# EAGLE design TLC4LED (EAGLE 6.2)
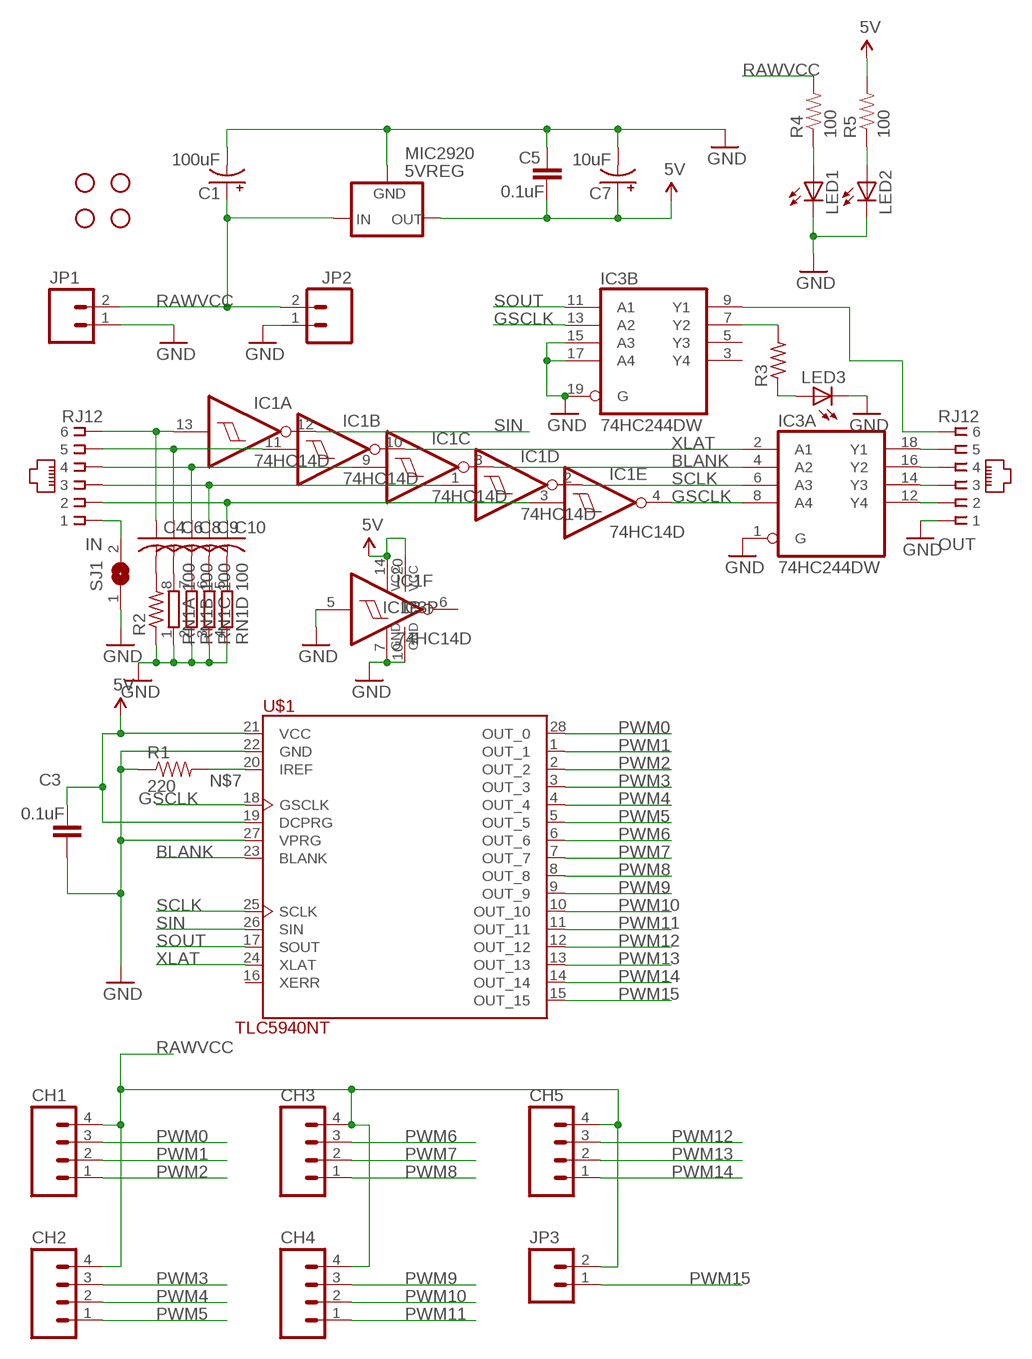
[diagram p0: schematic, sheet 1]

## Parts
5VREG  MIC2920  V_REG_MIC2920  [SOT223]
C1  100uF  CAP_POLD  [PANASONIC_D]
C3  0.1uF  CAP0805  [0805]
C4  C-US025-025X050  [C025-025X050]
C5  0.1uF  CAP0805  [0805]
C6  C-US025-025X050  [C025-025X050]
C7  10uF  CAP_POL1206  [EIA3216]
C8  C-US025-025X050  [C025-025X050]
C9  C-US025-025X050  [C025-025X050]
C10  C-US025-025X050  [C025-025X050]
CH1  M04SCREW  [SCREWTERMINAL-3.5MM-4]
CH2  M04SCREW  [SCREWTERMINAL-3.5MM-4]
CH3  M04SCREW  [SCREWTERMINAL-3.5MM-4]
CH4  M04SCREW  [SCREWTERMINAL-3.5MM-4]
CH5  M04SCREW  [SCREWTERMINAL-3.5MM-4]
IC1  74HC14D  [SO14]
IC3  74HC244DW  [SO20W]
IN  RJ12  RJ11-6L-B  [RJ11-NO_SHIELD]
JP1  M023.5MM  [SCREWTERMINAL-3.5MM-2]
JP2  M023.5MM  [SCREWTERMINAL-3.5MM-2]
JP3  M023.5MM  [SCREWTERMINAL-3.5MM-2]
JP4  STAND-OFF  [STAND-OFF]
JP5  STAND-OFF  [STAND-OFF]
JP6  STAND-OFF  [STAND-OFF]
JP7  STAND-OFF  [STAND-OFF]
LED1  LEDCHIPLED_0805  [CHIPLED_0805]
LED2  LEDCHIPLED_0805  [CHIPLED_0805]
LED3  LEDCHIPLED_0805  [CHIPLED_0805]
OUT  RJ12  RJ11-6L-B  [RJ11-NO_SHIELD]
R1  220  RESISTOR0805-RES  [0805]
R2  R-US_R0805  [R0805]
R3  R-US_R0805  [R0805]
R4  100  RESISTOR0805-RES  [0805]
R5  100  RESISTOR0805-RES  [0805]
RN1  100  4R-NEXBS8V  [EXBS8V]
SJ1  SJ  [SJ]
U$1  TLC5940NT  [DIP-28]

## Nets
5V [medium]: 5VREG.3(OUT) C3.2 C5.1 C7.A(+) IC1.14(P:VCC) IC3.20(P:VCC) R5.2 U$1.19(DCPRG) U$1.21(VCC)
BLANK: IC1.8(C:O) IC3.4(A:A2) U$1.23(BLANK)
GND [PWR]: 5VREG.2(GND) C1.- C3.1 C5.2 C7.C(-) IC1.5(F:I) IC1.7(P:GND) IC3.1(A:G) IC3.10(P:GND) IC3.15(B:A3) IC3.17(B:A4) IC3.19(B:G) JP1.1 JP2.1 LED1.C LED2.C LED3.C OUT.1 R1.1 R2.1 RN1.1 RN1.2 RN1.3 RN1.4 SJ1.1 U$1.22(GND) U$1.27(VPRG)
GSCLK: IC1.4(E:O) IC3.8(A:A4) IC3.13(B:A2) U$1.18(GSCLK)
N$1: IC3.12(A:Y4) OUT.2
N$2: IC3.14(A:Y3) OUT.3
N$3: IC3.16(A:Y2) OUT.4
N$4: IC3.18(A:Y1) OUT.5
N$5: LED2.A R5.1
N$6: LED1.A R4.1
N$7: R1.2 U$1.20(IREF)
N$8: C4.1 IC1.13(A:I) IN.6
N$9: C6.1 IC1.11(B:I) IN.5
N$10: C8.1 IC1.9(C:I) IN.4
N$11: C10.2 RN1.5
N$12: C9.2 RN1.6
N$13: C8.2 RN1.7
N$14: C9.1 IC1.1(D:I) IN.3
N$15: C10.1 IC1.3(E:I) IN.2
N$16: C6.2 RN1.8
N$17: C4.2 R2.2
N$18: IC3.9(B:Y1) OUT.6
N$19: IN.1 SJ1.2
N$20: IC3.7(B:Y2) R3.2
N$21: LED3.A R3.1
PWM0 [medium]: CH1.3 U$1.28(OUT_0)
PWM1 [medium]: CH1.2 U$1.1(OUT_1)
PWM2 [medium]: CH1.1 U$1.2(OUT_2)
PWM3 [medium]: CH2.3 U$1.3(OUT_3)
PWM4 [medium]: CH2.2 U$1.4(OUT_4)
PWM5 [medium]: CH2.1 U$1.5(OUT_5)
PWM6 [medium]: CH3.3 U$1.6(OUT_6)
PWM7 [medium]: CH3.2 U$1.7(OUT_7)
PWM8 [medium]: CH3.1 U$1.8(OUT_8)
PWM9 [medium]: CH4.3 U$1.9(OUT_9)
PWM10 [medium]: CH4.2 U$1.10(OUT_10)
PWM11 [medium]: CH4.1 U$1.11(OUT_11)
PWM12 [medium]: CH5.3 U$1.12(OUT_12)
PWM13 [medium]: CH5.2 U$1.13(OUT_13)
PWM14 [medium]: CH5.1 U$1.14(OUT_14)
PWM15 [medium]: JP3.1 U$1.15(OUT_15)
RAWVCC [PWR]: 5VREG.1(IN) C1.+ CH1.4 CH2.4 CH3.4 CH4.4 CH5.4 JP1.2 JP2.2 JP3.2 R4.2
SCLK: IC1.2(D:O) IC3.6(A:A3) U$1.25(SCLK)
SIN: IC1.12(A:O) U$1.26(SIN)
SOUT: IC3.11(B:A1) U$1.17(SOUT)
XLAT: IC1.10(B:O) IC3.2(A:A1) U$1.24(XLAT)
Unconnected: IC1.6(F:O) IC3.3(B:Y4) IC3.5(B:Y3) U$1.16(XERR)

## Library data of the parts
5VREG = SparkFun:V_REG_MIC2920: MIC2920A (http://www.micrel.com/_PDF/mic2920.pdf) - 400mA output LDO Regulator
C1 C7 = SparkFun:CAP_POL: Capacitor Polarized These are standard SMD and PTH capacitors. Normally 10uF, 47uF, and 100uF in electrolytic and tantalum varieties. Always verify the external diameter of the through hole cap, it varies with capacity, voltage, and manufacturer. The EIA devices should be standard.
C3 C5 = SparkFun:CAP: Capacitor Standard 0603 ceramic capacitor, and 0.1" leaded capacitor.
C4 C6 C8-C10 = rcl:C-US: CAPACITOR, American symbol
CH1-CH5 = SparkFun:M04: Header 4 Standard 4-pin 0.1" header. Use with straight break away headers (SKU : PRT-00116), right angle break away headers (PRT-00553), swiss pins (PRT-00743), machine pins (PRT-00117), and female headers (PRT-00115). Molex polarized connector foot print use with SKU : PRT-08231 with associated crimp pins and housings. 1MM SMD Version SKU: PRT-10208
IC1 = 74xx-eu:74*14: Hex schmitt trigger INVERTER
IC3 = 74xx-eu:74*244: Octal BUFFER and LINE DRIVER, 3-state
IN OUT = con-tycoelectronics:RJ11: CORCOM Modular RJ Jacks No Shield Source: www.tycoelectronics.com .. ENG_DS_1654001_1099_RJ_L_0507.pdf; MF: TYCO ELECTRONICS; MPN: RJ11-6L-B; OC_FARNELL: unknown; OC_NEWARK: 52K3613
JP1-JP3 = SparkFun:M02: Header 2 Standard 2-pin 0.1" header. Use with straight break away headers (SKU : PRT-00116), right angle break away headers (PRT-00553), swiss pins (PRT-00743), machine pins (PRT-00117), and female headers (PRT-00115). Molex polarized connector foot print use with SKU : PRT-08233 with associated crimp pins and housings.
JP4-JP7 = SparkFun:STAND-OFF: Stand Off This is the mechanical footprint for a #4 phillips button head screw. Use the keepout ring to avoid running the screw head into surrounding components. SKU : PRT-00447
LED1-LED3 = led:LED: LED OSRAM: - CHIPLED LG R971, LG N971, LY N971, LG Q971, LY Q971, LO R971, LY R971 LH N974, LH R974 LS Q976, LO Q976, LY Q976 LO Q996 - Hyper CHIPLED LW Q18S LB Q993, LB Q99A, LB R99A - SideLED LS A670, LO A670, LY A670, LG A670, LP A670 LB A673, LV A673, LT A673, LW A673 LH A674 LY A675 LS A676, LA A676, LO A676, LY A676, LW A676 LS A679, LY A679, LG A679 - Hyper Micro SIDELED® LS Y876, LA Y876, LO Y876, LY Y876 LT Y87S - SmartLED LW L88C, LW L88S LB L89C, LB L89S, LG L890 LS L89K, LO L89K, LY L89K LS L896, LA L896, LO L896, LY L896 - TOPLED LS T670, LO T670, LY T670, LG T670, LP T670 LSG T670, LSP T670, LSY T670, LOP T670, LYG T670 LG T671, LOG T671, LSG T671 LB T673, LV T673, LT T673, LW T673 LH T674 LS T676, LA T676, LO T676, LY T676, LB T676, LH T676, LSB T676, LW T676 LB T67C, LV T67C, LT T67C, LS T67K, LO T67K, LY T67K, LW E67C LS E67B, LA E67B, LO E67B, LY E67B, LB E67C, LV E67C, LT E67C LW T67C LS T679, LY T679, LG T679 LS T770, LO T770, LY T770, LG T770, LP T770 LB T773, LV T773, LT T773, LW T773 LH T774 LS E675, LA E675, LY E675, LS T675 LS T776, LA T776, LO T776, LY T776, LB T776 LHGB T686 LT T68C, LB T68C - Hyper Mini TOPLED® LB M676 - Mini TOPLED Santana® LG M470 LS M47K, LO M47K, LY M47K Source: http://www.osram.convergy.de LUXEON: - LUMILED® LXK2-PW12-R00, LXK2-PW12-S00, LXK2-PW14-U00, LXK2-PW14-V00 LXK2-PM12-R00, LXK2-PM12-S00, LXK2-PM14-U00 LXK2-PE12-Q00, LXK2-PE12-R00, LXK2-PE12-S00, LXK2-PE14-T00, LXK2-PE14-U00 LXK2-PB12-K00, LXK2-PB12-L00, LXK2-PB12-M00, LXK2-PB14-N00, LXK2-PB14-P00, LXK2-PB14-Q00 LXK2-PR12-L00, LXK2-PR12-M00, LXK2-PR14-Q00, LXK2-PR14-R00 LXK2-PD12-Q00, LXK2-PD12-R00, LXK2-PD12-S00 LXK2-PH12-R00, LXK2-PH12-S00 LXK2-PL12-P00, LXK2-PL12-Q00, LXK2-PL12-R00 Source: www.luxeon.com KINGBRIGHT: KA-3528ASYC Source: www.kingbright.com
R1 R4 R5 = SparkFun:RESISTOR: Resistor Basic schematic elements and footprints for 0603, 1206, and PTH resistors.
R2 R3 = rcl:R-US_: RESISTOR, American symbol
RN1 = resistor-dil:4R-N: Array Chip Resistor Source: RS Component / Phycomp; OC_FARNELL: unknown; OC_NEWARK: unknown
SJ1 = jumper:SJ: SMD solder JUMPER
U$1 = tlc5940:TLC5940

## Net classes
0 SIGNAL: width 0.254 mm
1 PWR: width 0.508 mm
2 medium: width 0.305 mm

## Board
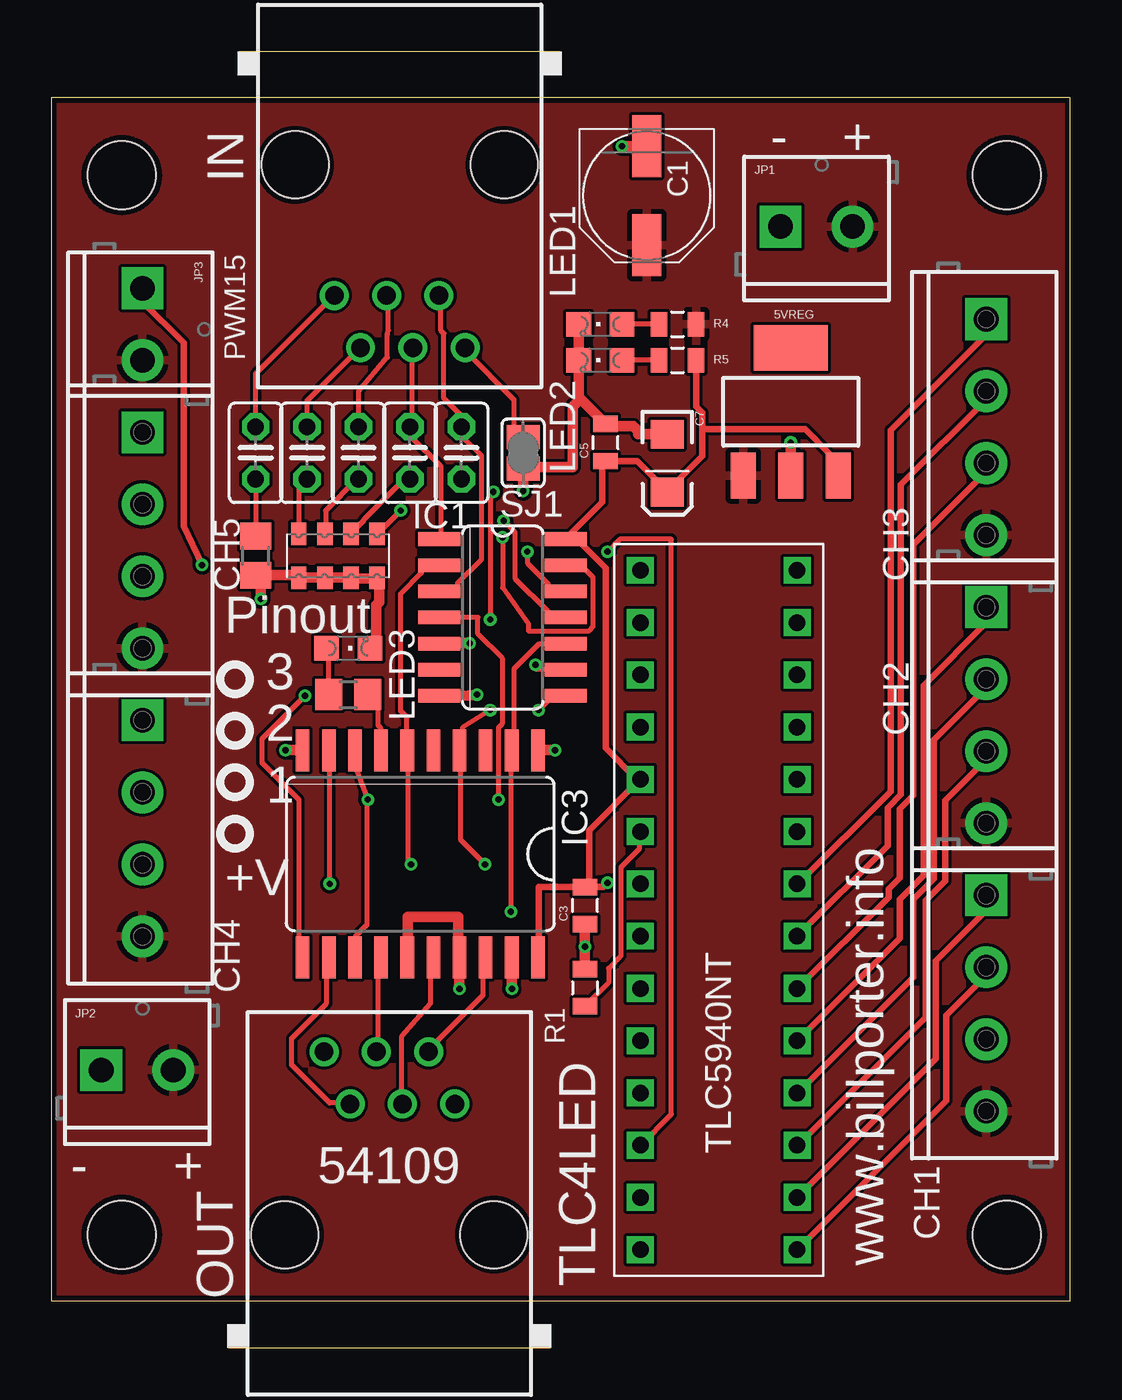
[diagram p1: board, top side]
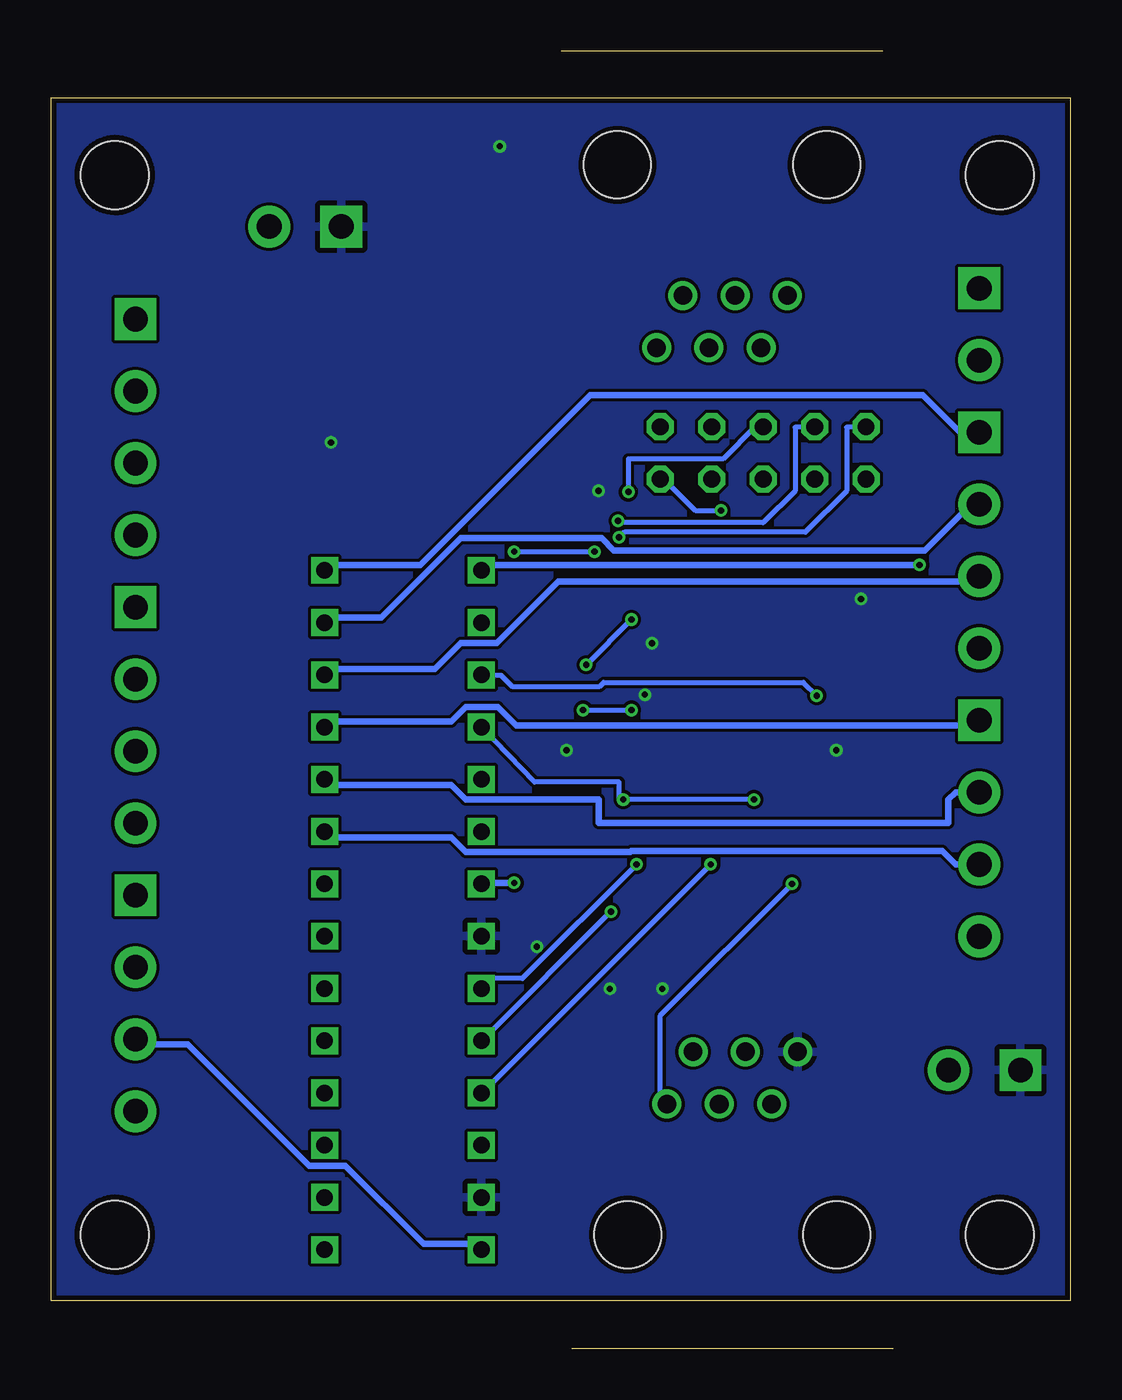
[diagram p2: board, bottom side, seen from below]

Size 49.5 x 58.49 mm. Coordinates in mm from the lower left corner, seen from the top.
Outline: 0,0 49.5,0 49.5,58.49 0,58.49 0,0
Copper layers (1*16): Top 0.035mm / dielectric 1.5mm / Bottom 0.035mm
Design rules: minimum track width 6mil, minimum drill 12mil, track to track 6mil, track to pad 6mil, pad to pad 6mil, via to via 6mil, smd to smd 0mil, copper to edge 10mil, drill to drill 10mil, minimum pad ring 10mil, minimum via ring 6mil, stop-mask expansion 2mil, vias tented up to drill 100mil, thermal gap 10mil

### Footprints (pad centres in the part's own frame; a part is rotated, then mirrored left to right if it is on the bottom)
SOT223 = smd 1.219 x 2.235: 1 -2.311,-3.099; 2 0,-3.099; 3 2.311,-3.099 | smd 3.6 x 2.2: 4 0,3.099
PANASONIC_D = smd 3 x 1.4: + 2.4,0; - -2.4,0
0805 = smd 0.8 x 1.2: 1 -0.9,0; 2 0.9,0
C025-025X050 = drill 0.813 octagon: 1 -1.27,0; 2 1.27,0
EIA3216 = smd 1.4 x 1.6: A 1.4,0; C -1.4,0
SCREWTERMINAL-3.5MM-4 = drill 1.2 pad 2.032 square: 1 0,0 | drill 1.2 pad 2.032: 2 3.5,0; 3 7,0; 4 10.5,0
SO14 = smd 0.66 x 2.032: 1 -3.81,-3.073; 2 -2.54,-3.073; 3 -1.27,-3.073; 4 0,-3.073; 5 1.27,-3.073; 6 2.54,-3.073; 7 3.81,-3.073; 8 3.81,3.073; 9 2.54,3.073; 10 1.27,3.073; 11 0,3.073; 12 -1.27,3.073; 13 -2.54,3.073; 14 -3.81,3.073
SO20W = smd 0.66 x 2.032: 1 -5.715,-5.029; 2 -4.445,-5.029; 3 -3.175,-5.029; 4 -1.905,-5.029; 5 -0.635,-5.029; 6 0.635,-5.029; 7 1.905,-5.029; 8 3.175,-5.029; 9 4.445,-5.029; 10 5.715,-5.029; 11 5.715,5.029; 12 4.445,5.029; 13 3.175,5.029; 14 1.905,5.029; 15 0.635,5.029; 16 -0.635,5.029; 17 -1.905,5.029; 18 -3.175,5.029; 19 -4.445,5.029; 20 -5.715,5.029
RJ11-NO_SHIELD = drill 0.9 pad 1.4: 1 -3.175,8.89; 2 -1.905,6.35; 3 -0.635,8.89; 4 0.635,6.35; 5 1.905,8.89; 6 3.175,6.35 | hole 3.251: -5.08,0; 5.08,0
SCREWTERMINAL-3.5MM-2 = drill 1.2 pad 2.032 square: 1 0,0 | drill 1.2 pad 2.032: 2 3.5,0
STAND-OFF = hole 3.302: 0,0
CHIPLED_0805 = smd 1.2 x 1.2: A 0,-1.05; C 0,1.05
R0805 = smd 1.3 x 1.5: 1 -0.95,0; 2 0.95,0
EXBS8V = smd 0.75 x 1.1: 1 -1.905,-1.07; 2 -0.635,-1.07; 3 0.635,-1.07; 4 1.905,-1.07; 5 1.905,1.07; 6 0.635,1.07; 7 -0.635,1.07; 8 -1.905,1.07
SJ = smd 1.168 x 1.6: 1 -0.762,0; 2 0.762,0
DIP-28 = drill 0.8 square: 1 -3.81,-1.27; 2 -3.81,-3.81; 3 -3.81,-6.35; 4 -3.81,-8.89; 5 -3.81,-11.43; 6 -3.81,-13.97; 7 -3.81,-16.51; 8 -3.81,-19.05; 9 -3.81,-21.59; 10 -3.81,-24.13; 11 -3.81,-26.67; 12 -3.81,-29.21; 13 -3.81,-31.75; 14 -3.81,-34.29; 15 3.81,-34.29; 16 3.81,-31.75; 17 3.81,-29.21; 18 3.81,-26.67; 19 3.81,-24.13; 20 3.81,-21.59; 21 3.81,-19.05; 22 3.81,-16.51; 23 3.81,-13.97; 24 3.81,-11.43; 25 3.81,-8.89; 26 3.81,-6.35; 27 3.81,-3.81; 28 3.81,-1.27

### Placement (x,y rotation side)
5VREG  35.92,43.22 0 top
C1  28.92,53.72 270 top
C3  25.92,19.22 90 top
C4  9.92,41.22 270 top
C5  26.92,41.72 90 top
C6  12.42,41.22 270 top
C7  29.92,40.72 270 top
C8  14.92,41.22 270 top
C9  17.42,41.22 270 top
C10  19.92,41.22 270 top
CH1  45.42,19.72 270 top
CH2  45.42,33.72 270 top
CH3  45.42,47.72 270 top
CH4  4.42,28.22 270 top
CH5  4.42,42.22 270 top
IC1  21.92,33.22 270 top
IC3  17.92,21.72 180 top
IN  16.92,55.22 180 top
JP1  35.42,52.22 0 top
JP2  2.42,11.22 0 top
JP3  4.42,49.22 270 top
JP4  3.42,3.22 0 top
JP5  46.42,3.22 0 top
JP6  3.42,54.72 0 top
JP7  46.42,54.72 0 top
LED1  26.67,47.47 90 top
LED2  26.67,45.72 90 top
LED3  14.42,31.72 270 top
OUT  16.42,3.22 0 top
R1  25.92,15.22 270 top
R2  9.92,36.22 90 top
R3  14.42,29.47 0 top
R4  30.42,47.47 0 top
R5  30.42,45.72 0 top
RN1  13.92,36.22 0 top
SJ1  22.92,41.22 90 top
U$1  32.42,1.22 180 top

### Tracks (layer width: path | path; a pad name or v marks a point on that pad's centre or on a via)
5V  (via drill 0.3)
  Top 0.305: C3.2 23.67,20.12 23.67,16.72 IC3.20 | v27.02,20.32 26.82,20.12 C3.2 | C3.2 26.12,20.27 26.12,22.87 28.57,25.32 U$1.19 28.42,25.37 26.92,26.87 26.92,35.62 25.37,37.17 25.37,37.22 IC1.14 25.02,37.07 26.77,38.82 26.77,40.77 C5.1 28.47,40.82 29.92,39.37 C7.A 30.02,39.47 31.62,41.07 31.62,42.37 | R5.2 31.32,43.47 31.62,43.17 31.62,42.37 | 31.62,42.37 36.62,42.37 37.82,41.17 37.82,40.57 38.22,40.17 5VREG.3
  Bottom 0.305: v27.02,20.32 28.52,20.32 28.57,20.27 U$1.21
BLANK  (via drill 0.3)
  Top 0.254: v21.32,28.72 19.97,27.87 19.97,27.37 19.87,26.77 IC3.4 19.87,26.67 19.87,22.42 v21.07,21.22 | v23.67,28.72 24.32,29.37 24.97,29.37 IC1.8
  Bottom 0.254: v23.67,28.72 v21.32,28.72 | v21.07,21.22 26.62,15.67 28.12,15.67 28.57,15.22 U$1.23
GND  (via drill 0.3)
  Top 0.508: 18.87,29.42 IC1.7 20.27,29.42 v20.67,29.47 | 12.22,26.77 IC3.10 11.97,26.77 v11.37,26.77 | C3.1 v25.92,17.22 R1.1 | v22.92,39.37 SJ1.1 23.17,40.52 25.32,40.52 25.32,43.47 25.7,43.84 | 25.7,43.84 25.62,43.92 LED2.C LED1.C | 25.7,43.84 C5.2 27.17,42.52 28.27,42.52 28.52,42.27 28.52,42.12 C7.C | v19.82,15.17 19.82,16.67 IC3.17 19.82,16.97 19.82,17.12 19.77,17.62 19.77,18.67 17.32,18.67 17.32,16.72 IC3.15 | v22.37,15.17 22.37,16.67 IC3.19 | v24.47,26.77 23.67,26.77 IC3.1 | v20.32,31.97 18.87,31.97 IC1.5 | v35.92,41.72 5VREG.2 | v27.72,56.12 C1.- | v10.17,34.12 10.17,35.02 R2.1 11.77,35.27 RN1.1 12.02,35.17 13.27,35.17 RN1.2 13.52,35.17 14.52,35.17 RN1.3 14.82,35.12 15.82,35.12 RN1.4 15.92,34.87 15.92,33.97 15.77,33.82 15.77,32.02 LED3.C
  pour Bottom: -0.73,67.23 49.56,66.73 49.56,-1.23 -0.73,-2.23
GSCLK  (via drill 0.3)
  Top 0.254: IC3.8 14.77,26.62 14.77,25.97 v15.37,24.37 15.32,24.27 15.32,18.27 14.77,17.72 IC3.13 | IC1.4 20.72,33.22 20.72,32.42 21.92,31.22 21.92,28.07 21.72,27.87 v21.72,24.37
  Bottom 0.254: v15.37,24.37 v21.72,24.37 21.92,24.37 21.92,25.22 26.02,25.22 28.57,27.87 U$1.18
N$1
  Top 0.254: IC3.12 13.47,16.67 13.37,16.57 13.37,14.47 11.67,12.77 11.67,11.47 13.52,9.62 14.47,9.62 14.47,9.57 OUT.2
N$2
  Top 0.254: IC3.14 15.97,16.67 15.87,16.57 15.87,12.17 15.82,12.12 OUT.3
N$3
  Top 0.254: IC3.16 18.52,16.67 18.42,16.57 18.42,14.47 17.02,12.87 17.02,9.57 OUT.4
N$4
  Top 0.254: IC3.18 21.07,16.67 20.97,16.57 20.97,14.87 18.37,12.27 18.37,12.12 OUT.5
N$5
  Top 0.254: R5.1 LED2.A
N$6
  Top 0.254: R4.1 LED1.A
N$7
  Top 0.254: R1.2 27.07,15.47 27.07,16.17 27.67,16.77 27.67,21.07 28.57,21.97 28.57,22.77 U$1.20
N$8  (via drill 0.3)
  Top 0.254: v21.92,37.12 21.92,34.67 23.17,32.92 23.17,32.57 26.12,32.57 26.32,32.77 26.32,35.17 25.87,35.62 25.87,35.72 25.02,35.72 IC1.13 | C4.1 9.92,45.07 13.72,48.87 IN.6
  Bottom 0.254: v21.92,37.12 21.67,37.37 12.87,37.37 10.87,39.37 10.87,42.47 9.92,42.47 C4.1
N$9  (via drill 0.3)
  Top 0.254: IC1.11 24.12,33.22 24.12,33.52 22.52,35.12 22.52,37.37 v21.97,37.92 | C6.1 12.42,43.77 14.97,46.32 IN.5
  Bottom 0.254: v21.97,37.92 21.87,37.82 14.92,37.82 13.37,39.37 13.37,42.47 12.42,42.47 C6.1
N$10  (via drill 0.3)
  Top 0.254: v23.52,30.92 23.52,30.72 24.97,30.72 IC1.9 | v21.32,33.12 21.32,39.17 v21.47,39.32 | C8.1 14.92,44.22 16.32,45.87 16.32,46.97 16.37,47.17 16.37,48.82 16.32,48.87 IN.4
  Bottom 0.254: v21.32,33.12 v23.52,30.92 | v21.47,39.32 21.47,40.92 16.87,40.92 15.32,42.47 14.92,42.47 C8.1
N$11  (via drill 0.3)
  Top 0.254: v16.97,38.42 15.87,37.32 RN1.5
  Bottom 0.254: v16.97,38.42 18.22,38.42 19.72,39.92 19.92,39.92 C10.2
N$12
  Top 0.254: RN1.6 14.57,37.32 15.17,37.92 15.17,37.97 17.12,39.92 17.42,39.92 C9.2
N$13
  Top 0.254: RN1.7 13.32,37.32 13.32,38.42 14.82,39.92 14.92,39.92 C8.2
N$14
  Top 0.254: IC1.1 18.87,37.07 18.92,37.12 18.92,40.57 17.42,42.07 C9.1 17.52,42.52 17.52,46.32 IN.3
N$15
  Top 0.254: IC1.3 18.87,34.52 19.72,34.52 19.72,34.87 20.87,36.02 20.87,41.12 19.92,42.07 C10.1 19.87,42.57 19.87,43.07 19.07,43.87 19.07,47.02 18.92,47.17 18.92,48.82 18.87,48.87 IN.2
N$16
  Top 0.254: RN1.8 12.02,37.32 12.02,39.52 12.42,39.92 C6.2
N$17
  Top 0.254: C4.2 R2.2
N$18  (via drill 0.3)
  Top 0.254: v13.52,20.27 13.52,26.72 IC3.9
  Bottom 0.254: v13.52,20.27 19.92,13.87 19.92,9.57 OUT.6
N$19
  Top 0.254: SJ1.2 22.92,42.02 22.47,42.47 22.47,43.82 20.12,46.17 20.12,46.32 IN.1
N$20
  Top 0.254: R3.2 15.87,28.97 15.87,27.97 16.02,27.82 16.02,26.77 IC3.7
N$21
  Top 0.254: LED3.A 13.47,31.62 R3.1
PWM0
  Bottom 0.305: CH1.3 44.77,12.72 44.52,12.47 42.87,12.47 36.97,6.57 35.22,6.57 31.42,2.77 28.87,2.77 28.62,2.52 U$1.28
PWM1
  Top 0.305: CH1.2 45.42,15.82 43.47,13.87 43.47,9.72 36.27,2.52 U$1.1
PWM2
  Top 0.305: U$1.2 42.97,11.77 42.97,16.52 45.42,18.97 CH1.1
PWM3
  Top 0.305: CH2.3 45.42,26.32 43.42,24.32 43.42,20.42 42.47,19.47 42.47,13.77 36.27,7.57 U$1.3
PWM4
  Top 0.305: CH2.2 45.42,29.82 42.87,27.27 42.87,20.52 41.87,19.52 41.87,15.72 36.27,10.12 U$1.4
PWM5
  Top 0.305: CH2.1 45.42,32.97 42.37,29.92 42.37,20.67 41.22,19.52 41.22,17.62 36.27,12.67 U$1.5
PWM6
  Top 0.305: CH3.3 45.42,40.32 41.87,36.77 41.87,24.57 41.22,23.92 41.22,20.57 40.67,20.02 40.67,19.62 36.27,15.22 U$1.6
PWM7
  Top 0.305: U$1.7 40.62,22.12 40.62,23.97 41.27,24.62 41.27,39.67 45.42,43.82 CH3.2
PWM8
  Top 0.305: CH3.1 45.42,46.97 40.77,42.32 40.77,24.77 36.27,20.27 U$1.8
PWM9
  Bottom 0.305: CH4.3 5.57,21.22 6.22,21.87 21.32,21.87 21.37,21.82 29.37,21.82 30.07,22.52 35.97,22.52 36.22,22.77 U$1.9
PWM10
  Bottom 0.305: CH4.2 5.57,24.72 5.92,24.37 5.92,23.22 22.92,23.22 22.92,24.37 29.37,24.37 30.07,25.07 35.97,25.07 36.22,25.32 U$1.10
PWM11
  Bottom 0.305: CH4.1 4.67,27.97 26.92,27.97 27.82,28.87 29.37,28.87 30.07,28.17 35.97,28.17 36.22,27.92 U$1.11
PWM12
  Bottom 0.305: CH5.3 5.07,35.22 5.32,34.97 24.87,34.97 27.87,31.97 29.62,31.97 30.87,30.72 35.97,30.72 36.22,30.47 U$1.12
PWM13
  Bottom 0.305: CH5.2 4.82,38.72 7.07,36.47 22.17,36.47 22.77,37.07 29.62,37.07 33.47,33.22 35.97,33.22 U$1.13
PWM14
  Bottom 0.305: U$1.14 35.97,35.77 31.57,35.77 23.32,44.02 7.17,44.02 5.37,42.22 CH5.1
PWM15  (via drill 0.3)
  Top 0.305: v7.32,35.77 6.42,37.67 6.42,46.57 4.42,48.57 JP3.1
  Bottom 0.305: v7.32,35.77 28.32,35.77 28.57,35.52 U$1.15
RAWVCC
  pour Top: -0.73,67.23 49.06,67.23 50.06,-1.73 -0.73,-2.23
SCLK  (via drill 0.3)
  Top 0.254: v17.47,21.22 17.32,21.37 17.32,26.62 IC3.6 17.27,26.87 17.27,28.37 16.97,28.67 16.97,34.37 17.97,35.37 17.97,35.72 18.82,35.72 IC1.2
  Bottom 0.254: v17.47,21.22 28.57,10.12 U$1.25
SIN  (via drill 0.3)
  Top 0.254: v23.12,36.42 23.12,35.87 24.12,34.87 24.12,34.52 24.97,34.52 IC1.12 | v27.02,36.42 27.62,37.02 30.12,37.02 30.12,9.07 U$1.26
  Bottom 0.254: v27.02,36.42 v23.12,36.42
SOUT  (via drill 0.3)
  Top 0.254: v12.32,29.42 10.22,27.32 10.22,26.17 12.02,24.37 12.02,16.87 12.17,16.72 IC3.11
  Bottom 0.254: v12.32,29.42 12.97,30.07 22.67,30.07 22.87,29.87 27.12,29.87 27.67,30.42 28.57,30.42 U$1.17
XLAT  (via drill 0.3)
  Top 0.254: IC1.10 24.97,31.92 23.67,31.92 22.47,30.72 22.47,26.87 22.37,26.77 IC3.2 22.32,26.67 v22.32,18.92
  Bottom 0.254: v22.32,18.92 28.57,12.67 U$1.24

### Text on the board
tNames: - | + | PWM15 | Pinout | 3 | 2 | 1 | +V | - | + | 54109 | www.billporter.info | TLC4LED